# EAGLE schematic auto_power (EAGLE 9.2.2)
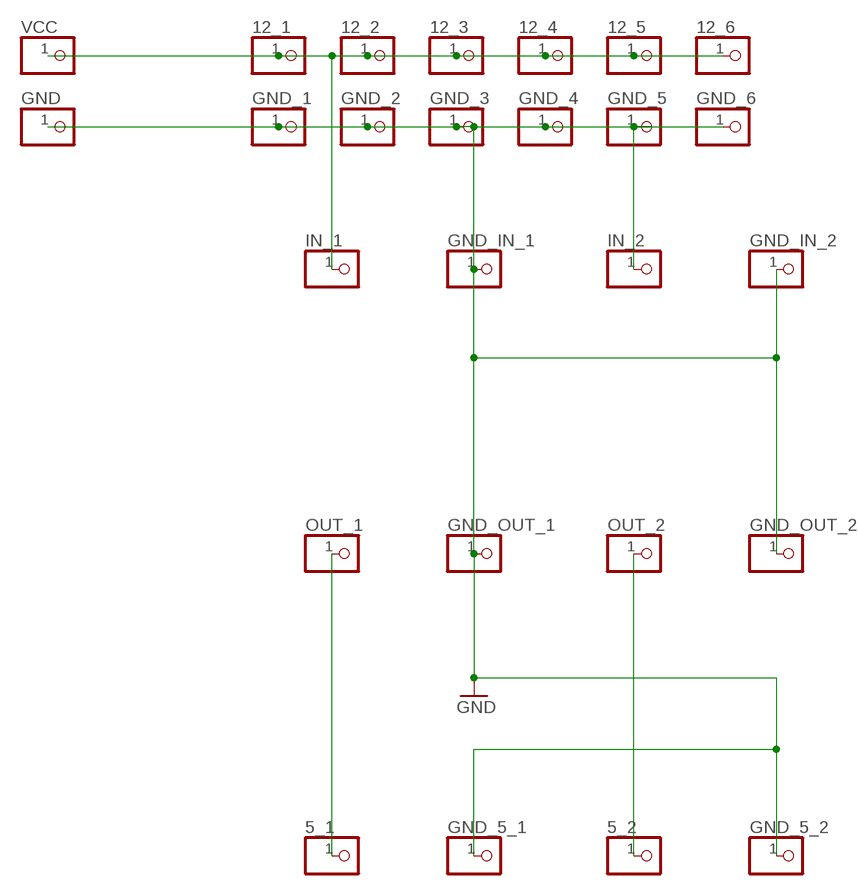
[diagram p0: schematic, sheet 1]

## Parts
5_1  PINHD-1X1  [1X01]
5_2  PINHD-1X1  [1X01]
12_1  PINHD-1X1  [1X01]
12_2  PINHD-1X1  [1X01]
12_3  PINHD-1X1  [1X01]
12_4  PINHD-1X1  [1X01]
12_5  PINHD-1X1  [1X01]
12_6  PINHD-1X1  [1X01]
GND  PINHD-1X1  [1X01]
GND_1  PINHD-1X1  [1X01]
GND_2  PINHD-1X1  [1X01]
GND_3  PINHD-1X1  [1X01]
GND_4  PINHD-1X1  [1X01]
GND_5  PINHD-1X1  [1X01]
GND_5_1  PINHD-1X1  [1X01]
GND_5_2  PINHD-1X1  [1X01]
GND_6  PINHD-1X1  [1X01]
GND_IN_1  PINHD-1X1  [1X01]
GND_IN_2  PINHD-1X1  [1X01]
GND_OUT_1  PINHD-1X1  [1X01]
GND_OUT_2  PINHD-1X1  [1X01]
IN_1  PINHD-1X1  [1X01]
IN_2  PINHD-1X1  [1X01]
OUT_1  PINHD-1X1  [1X01]
OUT_2  PINHD-1X1  [1X01]
VCC  PINHD-1X1  [1X01]

## Nets
GND: GND.1 GND_1.1 GND_2.1 GND_3.1 GND_4.1 GND_5.1 GND_5_1.1 GND_5_2.1 GND_6.1 GND_IN_1.1 GND_IN_2.1 GND_OUT_1.1 GND_OUT_2.1 IN_2.1
N$1: 5_1.1 OUT_1.1
N$2: 5_2.1 OUT_2.1
N$3: 12_1.1 12_2.1 12_3.1 12_4.1 12_5.1 12_6.1 IN_1.1 VCC.1

## Library data of the parts
5_1 5_2 12_1-12_6 GND GND_1-GND_5 GND_5_1 GND_5_2 GND_6 GND_IN_1 GND_IN_2 GND_OUT_1 GND_OUT_2 IN_1 IN_2 OUT_1 OUT_2 VCC = pinhead:PINHD-1X1: PIN HEADER